# EasyEDA Pro project PCB.epro

# Board PCB_CardReader
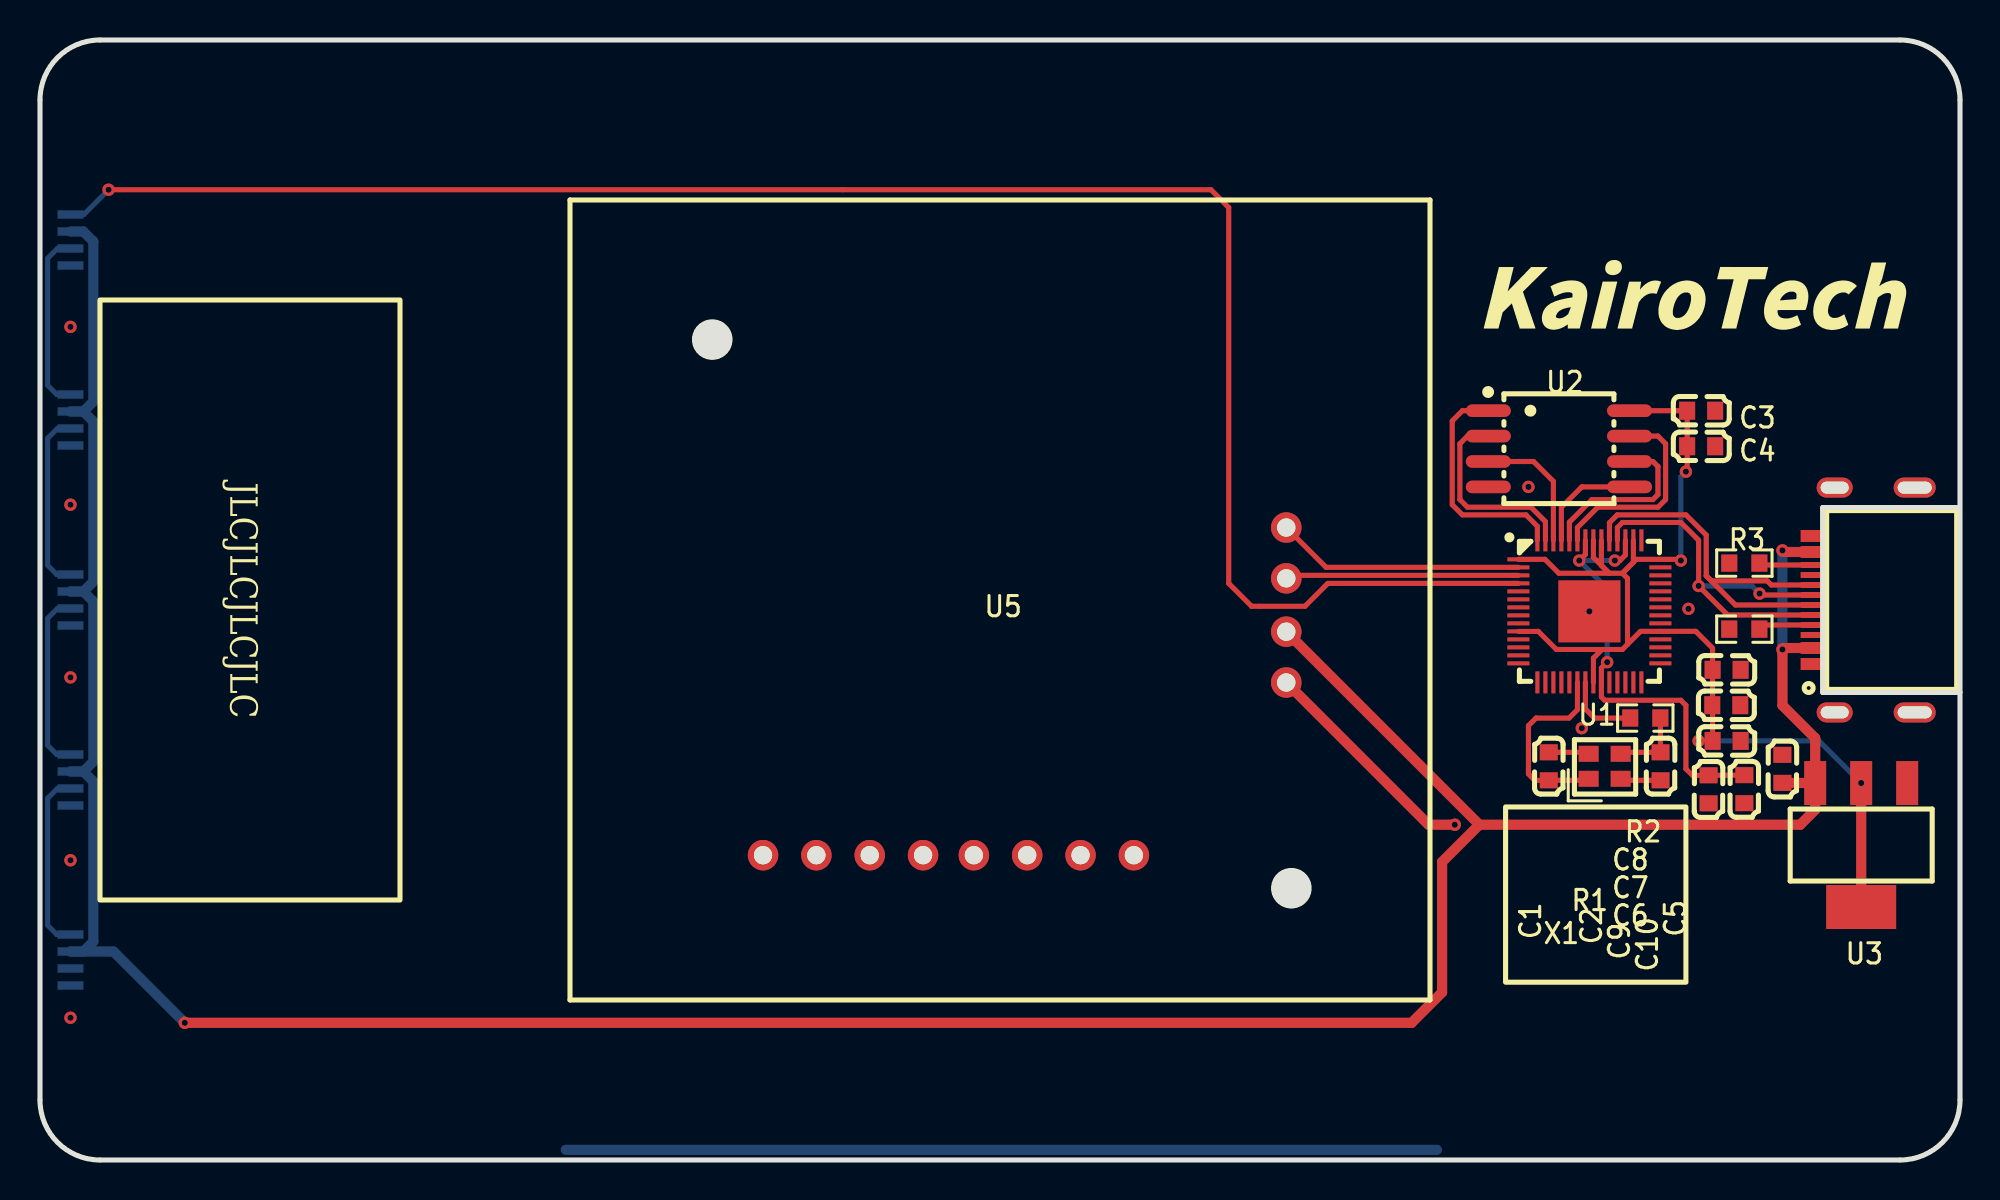
[diagram p0: board, top side]
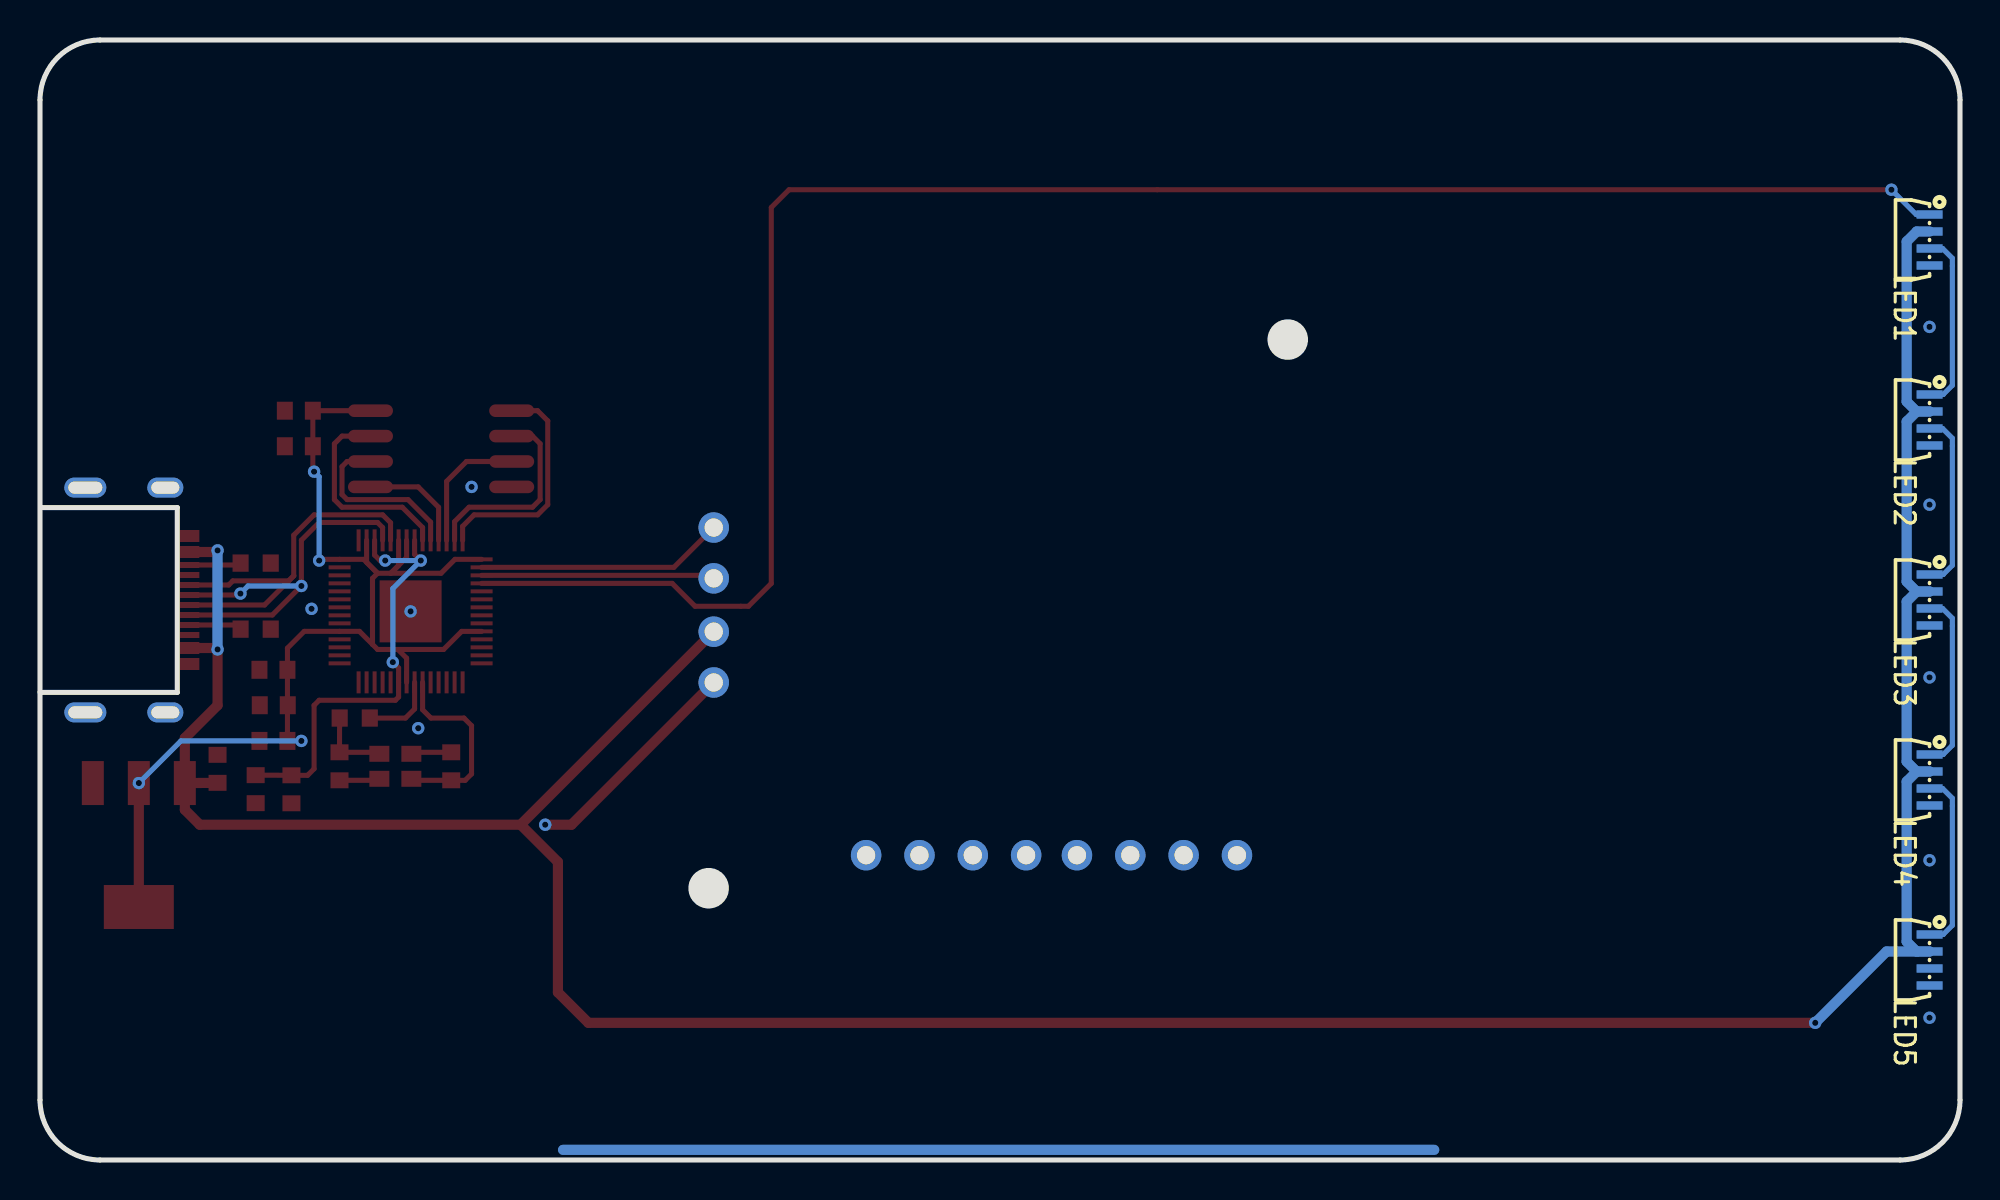
[diagram p1: board, bottom side, seen from below]

Outline 96 x 56 mm; copper layers: Top Layer, Bottom Layer. Coordinates in mm from the lower left corner of the outline.
Outline path: 0,53 arc(0.88,55.12) 3,56 93,56 arc(95.12,55.12) 96,53 96,3 arc(95.12,0.88) 93,0 3,0 arc(0.88,0.88) 0,3 0,53
Stack: Top Layer 0.035mm / Dielectric1 1.51mm FR4 er 4.5 / Bottom Layer 0.035mm

## Design rules (mm)
spacing Default (default): track to track 0.127, other pairs 0 to 0.127
track width Default (default): min 0.254, default 0.254, max 25.4
differential pair differentialPair (default): width min 0.127, default 0.254, max 2.54; gap min 0.152, default 0.152
via Default (default): diameter min 0.61, default 0.61, max 100.025; hole min 0.305, default 0.305, max 59.995
net GND uses gge8944
pour e61 uses gge8343
pour e62 uses gge8923
pour e219 uses gge8343(1)
pour e220 uses gge8944

## Placement (name value [footprint] x y rotation side)
C1  12pF  [C0603]  75.44 19.69 270 top
C2  12pF  [C0603]  81.03 19.69 270 top
C3  100nF  [C0603]  83.06 37.47 180 top
C4  100nF  [C0603]  83.06 35.69 180 top
C5  0.1u  [C0603]  87.12 19.56 90 top
C6  100nF  [C0603]  84.33 20.95 180 top
C7  100nF  [C0603]  84.31 22.74 180 top
C8  100nF  [C0603]  84.33 24.51 180 top
C9  100nF  [C0603]  83.43 18.53 90 top
C10  100nF  [C0603]  85.22 18.54 90 top
LED1  WS2812B-4020  [LED-SMD_WS2812B-4020]  1.52 46 90 bottom
LED2  WS2812B-4020  [LED-SMD_WS2812B-4020]  1.52 37 90 bottom
LED3  WS2812B-4020  [LED-SMD_WS2812B-4020]  1.52 28 90 bottom
LED4  WS2812B-4020  [LED-SMD_WS2812B-4020]  1.52 19 90 bottom
LED5  WS2812B-4020  [LED-SMD_WS2812B-4020]  1.52 10 90 bottom
R1  1k  [R0603]  80.26 22.1 180 top
R2  1k  [R0603]  85.22 26.54 0 top
R3  1k  [R0603]  85.22 29.84 0 top
U1  RP2040  [LQFN-56_L7.0-W7.0-P0.4-EP]  77.47 27.43 0 top
U2  W25Q32JVSSIQ_C2834491  [SOIC-8_L5.2-W5.2-P1.27-LS7.9-BL]  75.95 35.56 270 top
U3  AMS1117-5.0_C347223  [SOT-223_L6.7-W3.5-P2.30-BR]  91.06 15.75 90 top
U5  pn532  [PN532]  26.5 8 0 top
USB  TYPE-610-1.6-T3  [USB-C-SMD_TYPE-C-16P-610-1.6-T3]  91.13 28 90 top
X1  12MHz  [CRYSTAL-SMD_4P-L2.5-W2.0-BL_XTAL12MHZ]  78.23 19.69 0 top

## Footprints (pads in the part's own frame, mm; a bottom-side part is the same pattern mirrored in y, then rotated)
C0603
  rect 0.8x0.9 smd: 1(-0.7,0) 2(0.7,0)
CRYSTAL-SMD_4P-L2.5-W2.0-BL_XTAL12MHZ
  rect 1x0.8 smd: 1(-0.8,-0.625) 2(0.8,-0.625) 3(0.8,0.625) 4(-0.8,0.625)
LED-SMD_WS2812B-4020
  rect 0.42x1.3 smd: 1(1.275,0.001) 2(0.425,0.001) 3(-0.425,0.001) 4(-1.275,0.001)
LQFN-56_L7.0-W7.0-P0.4-EP
  rect 1.1x0.2 smd: 1(-3.55,2.6) 2(-3.55,2.2) 3(-3.55,1.8) 4(-3.55,1.4) 5(-3.55,1) 6(-3.55,0.6) 7(-3.55,0.2) 8(-3.55,-0.2) 9(-3.55,-0.6) 10(-3.55,-1) 11(-3.55,-1.4) 12(-3.55,-1.8) 13(-3.55,-2.2) 14(-3.55,-2.6) 29(3.55,-2.6) 30(3.55,-2.2) 31(3.55,-1.8) 32(3.55,-1.4) 33(3.55,-1) 34(3.55,-0.6) 35(3.55,-0.2) 36(3.55,0.2) 37(3.55,0.6) 38(3.55,1) 39(3.55,1.4) 40(3.55,1.8) 41(3.55,2.2) 42(3.55,2.6)
  rect 0.2x1.1 smd: 15(-2.6,-3.55) 16(-2.2,-3.55) 17(-1.8,-3.55) 18(-1.4,-3.55) 19(-1,-3.55) 20(-0.6,-3.55) 21(-0.2,-3.55) 22(0.2,-3.55) 23(0.6,-3.55) 24(1,-3.55) 25(1.4,-3.55) 26(1.8,-3.55) 27(2.2,-3.55) 28(2.6,-3.55) 43(2.6,3.55) 44(2.2,3.55) 45(1.8,3.55) 46(1.4,3.55) 47(1,3.55) 48(0.6,3.55) 49(0.2,3.55) 50(-0.2,3.55) 51(-0.6,3.55) 52(-1,3.55) 53(-1.4,3.55) 54(-1.8,3.55) 55(-2.2,3.55) 56(-2.6,3.55)
  rect 3.1x3.1 smd: 57(0,0)
PN532
  round 1.524 hole 0.914: 1(35.814,23.622) 2(35.814,21.082) 3(35.814,18.415) 4(35.814,15.875) 5(28.194,7.239) 6(25.527,7.239) 7(22.86,7.239) 8(20.193,7.239) 9(17.653,7.239) 10(14.986,7.239) 11(12.319,7.239) 12(9.652,7.239)
R0603
  rect 0.806x0.864 smd: 1(-0.753,0) 2(0.753,0)
SOIC-8_L5.2-W5.2-P1.27-LS7.9-BL
  oval 0.63x2.25 smd: 1(-1.905,-3.53) 2(-0.635,-3.53) 3(0.635,-3.53) 4(1.905,-3.53) 5(1.905,3.53) 6(0.635,3.53) 7(-0.635,3.53) 8(-1.905,3.53)
SOT-223_L6.7-W3.5-P2.30-BR
  rect 2.2x1.1 smd: 1(3.099,-2.3) 2(3.099,0) 3(3.099,2.3)
  rect 2.2x3.5 smd: 4(-3.099,0)
USB-C-SMD_TYPE-C-16P-610-1.6-T3
  oval 1x2.1 hole 0.6x1.7: 0(5.62,-2.6) 2(-5.62,-2.6)
  oval 1x1.8 hole 0.6x1.4: 1(5.62,1.4) 3(-5.62,1.4)
  rect 0.6x1 smd: A1B12(-3.2,2.6) A4B9(-2.4,2.6) B1A12(3.2,2.6) B4A9(2.4,2.6)
  rect 0.3x1 smd: A5(-1.25,2.6) A6(-0.25,2.6) A7(0.25,2.6) A8(1.25,2.6) B5(1.75,2.6) B6(0.75,2.6) B7(-0.75,2.6) B8(-1.75,2.6)

## Nets
1V1: C9.2 C10.2 U1.23 U1.45 U1.50
3V3: C3.2 C4.2 C6.2 C7.2 C8.2 U1.1 U1.10 U1.22 U1.33 U1.42 U1.44 U1.48 U1.49 U2.8 U3.2 U3.4
GND: C1.1 C2.2 C3.1 C4.1 C5.2 C6.1 C7.1 C8.1 C9.1 C10.1 LED1.4 LED2.4 LED3.4 LED4.4 LED5.4 R2.1 R3.1 U1.57 U2.4 U3.1 U5.4 USB.0 USB.1 USB.2 USB.3 USB.A1B12 USB.B1A12 X1.2 X1.4
VCC: C5.1 LED1.2 LED2.2 LED3.2 LED4.2 LED5.2 U3.3 U5.3 USB.A4B9 USB.B4A9
ADC_ACDD: U1.43
GPIO3: U1.5
GPIO4: U1.6
GPIO5: U1.7
GPIO6: U1.8
GPIO7: U1.9
GPIO8: U1.11
GPIO9: U1.12
GPIO10: U1.13
GPIO11: U1.14
GPIO12: U1.15
GPIO13: U1.16
GPIO14: U1.17
GPIO15: U1.18
GPIO16: U1.27
GPIO17: U1.28
GPIO18: U1.29
GPIO19: U1.30
GPIO20: U1.31
GPIO21: U1.32
GPIO22: U1.34
GPIO23: U1.35
GPIO24: U1.36
GPIO25: U1.37
GPIO26_ADC0: U1.38
GPIO27_ADC1: U1.39
GPIO28_ADC2: U1.40
GPIO29_ADC3: U1.41
LED: LED1.1 U1.4
LED1_3: LED1.3 LED2.1
LED2_3: LED2.3 LED3.1
LED3_3: LED3.3 LED4.1
LED4_3: LED4.3 LED5.1
QSPI_SCLK: U1.52 U2.6
QSPI_SD0: U1.53 U2.5
QSPI_SD1: U1.55 U2.2
QSPI_SD2: U1.54 U2.3
QSPI_SD3: U1.51 U2.7
QSPI_SS: U1.56 U2.1
RUN: U1.26
SWCLK: U1.24
SWD: U1.25
UART0_RX: U1.3 U5.2
UART0_TX: U1.2 U5.1
USB_A5: R2.2 USB.A5
USB_B5: R3.2 USB.B5
USB_D+: U1.47 USB.A6 USB.B6
USB_D-: U1.46 USB.A7 USB.B7
X1_3: C2.1 R1.1 X1.3
XIN: C1.2 U1.20 X1.1
XOUT: R1.2 U1.21

Pads without a net: LED5 3; U1 19; U5 5 6 7 8 9 10 11 12; USB A8 B8

## Via types
v1: diameter 0.62, hole 0.31, Top Layer to Bottom Layer, 23 vias

## Routing (per net, layer and track width the routed paths; a pad name or vN(x,y) marks a point on that pad's centre or on a via; arc(x,y) is an arc through that point)
1V1: length 22.4
  Top Layer w0.254: C9.2 82.62,19.23 82.3,19.56 82.3,22.73 82.04,22.99 78.23,22.99 78.07,23.15 U1.23 78.07,24.6 v1(78.36,24.89) ; U1.50 77.27,30.28 v1(76.96,29.97) ; 85.22,19.24 83.43,19.24 ; v1(78.74,29.97) 78.99,29.97 79.27,30.25 U1.45
  Bottom Layer w0.254: v1(78.36,24.89) 78.36,28.58 v1(76.96,29.97) v1(78.74,29.97)
3V3: length 61
  Top Layer w0.254: 79.38,25.78 80.03,26.43 U1.33 82.79,26.43 83.63,25.59 C8.2 C6.2 ; 79.38,25.78 79.12,25.53 78.1,25.53 ; 79.38,25.78 79.38,29.08 79.12,29.34 ; 79.12,29.34 75.95,29.34 75.25,30.03 U1.1 ; 79.12,29.34 79.82,30.03 U1.42 81.98,30.03 v1(82.04,29.97) ; 79.12,29.34 79.67,29.89 U1.44 ; 78.1,25.53 77.67,25.09 77.67,23.88 ; 78.1,25.53 75.82,25.53 74.91,26.43 U1.10 ; 78.07,30.98 78.07,29.73 78.46,29.34 77.67,30.13 77.67,30.98 ; U2.8 C3.2 C4.2 82.36,34.48 v1(82.3,34.42)
  Top Layer w0.508: v1(91.06,18.85) U3.4
  Bottom Layer w0.254: v1(82.3,34.42) 82.04,34.16 v1(82.04,29.97) ; v1(82.93,20.95) 88.95,20.95 v1(91.06,18.85)
GND: length 59
  Top Layer w0.254: C1.1 77.36,20.39 X1.4 ; X1.2 79.11,18.98 C2.2
  Top Layer w0.508: v1(70.74,16.76) 69.43,16.76 U5.4
  Bottom Layer w0.508: 69.85,0.51 26.29,0.51
  vias: v1(1.52,41.66) v1(1.52,32.77) v1(1.52,24.13) v1(1.52,14.99) v1(1.52,7.11) v1(74.42,33.66) v1(77.09,21.59) v1(77.47,27.43) v1(82.42,27.56)
VCC: length 176.5
  Top Layer w0.508: v1(7.24,6.86) 68.58,6.86 70.1,8.38 70.1,14.9 71.97,16.76 ; v1(87.12,30.48) 87.2,30.4 USB.B4A9 ; USB.A4B9 87.19,25.6 v1(87.12,25.53) 87.12,22.73 88.76,21.1 U3.3 ; 87.12,18.86 88.76,18.85 88.76,17.51 88.01,16.76 71.97,16.76 ; 71.97,16.76 U5.3
  Bottom Layer w0.254: v1(87.12,30.48) v1(87.12,25.53)
  Bottom Layer w0.508: 1.52,19.43 2.16,19.43 2.67,18.92 2.67,10.92 2.17,10.42 LED5.2 3.67,10.42 v1(7.24,6.86) ; 1.52,28.43 2.16,28.43 2.67,27.92 2.67,19.92 2.17,19.42 LED4.2 ; LED3.2 2.17,28.42 2.67,28.92 2.67,36.92 2.16,37.43 1.52,37.43 ; LED2.2 2.17,37.42 2.67,37.92 2.67,45.92 2.16,46.43 1.52,46.43 ; v1(87.12,30.48) v1(87.12,25.53)
LED: length 93
  Top Layer w0.254: v1(3.43,48.51) 58.55,48.51 59.44,47.62 59.44,28.83 60.58,27.69 63.25,27.69 64.39,28.83 U1.4
  Bottom Layer w0.254: v1(3.43,48.51) 2.19,47.28 LED1.1
LED1_3: length 9
  Bottom Layer w0.254: LED1.3 0.87,45.58 0.38,45.08 0.38,38.73 0.84,38.28 LED2.1
LED2_3: length 9
  Bottom Layer w0.254: LED2.3 0.87,36.58 0.38,36.08 0.38,29.73 0.84,29.28 LED3.1
LED3_3: length 9
  Bottom Layer w0.254: LED3.3 0.87,27.58 0.38,27.08 0.38,20.73 0.84,20.28 LED4.1
LED4_3: length 9
  Bottom Layer w0.254: LED5.1 0.84,11.28 0.38,11.73 0.38,18.08 0.87,18.58 LED4.3
QSPI_SCLK: length 8.8
  Top Layer w0.254: 76.47,30.98 76.47,31.89 77.6,33.02 80.65,33.02 80.9,33.27 80.9,34.67 80.65,34.92 U2.6
QSPI_SD0: length 5.5
  Top Layer w0.254: U1.53 76.07,32.64 77.09,33.66 U2.5
QSPI_SD1: length 10
  Top Layer w0.254: 75.27,30.98 75.27,31.92 74.55,32.64 71.37,32.64 70.99,33.02 70.99,35.81 71.37,36.19 U2.2
QSPI_SD2: length 6.6
  Top Layer w0.254: U2.3 74.68,34.92 75.67,33.93 U1.54
QSPI_SD3: length 10.4
  Top Layer w0.254: U2.7 80.9,36.19 81.28,35.81 81.28,33.02 80.9,32.64 77.89,32.64 76.87,31.62 76.87,30.98
QSPI_SS: length 11.6
  Top Layer w0.254: 74.87,30.98 74.87,31.68 74.29,32.26 71.12,32.26 70.61,32.77 70.61,36.96 71.12,37.47 U2.1
UART0_RX: length 11.7
  Top Layer w0.254: U5.2 62.46,29.23 U1.3
UART0_TX: length 12.4
  Top Layer w0.254: U5.1 64.31,29.63 U1.2
USB_A5: length 2.9
  Top Layer w0.254: 88.79,26.75 86.18,26.75 R2.2
USB_B5: length 2.9
  Top Layer w0.254: 88.79,29.75 86.07,29.75 R3.2
USB_D+: length 20.1
  Top Layer w0.254: 83.31,29.21 83.57,28.96 86.36,28.96 86.57,28.75 88.79,28.75 ; 83.31,29.21 84.77,27.75 88.79,27.75 ; 83.31,29.21 83.31,31.24 82.3,32.26 78.87,32.26 78.47,31.86 78.47,30.98
USB_D-: length 20
  Top Layer w0.254: 88.79,27.25 84.38,27.25 v1(82.93,28.7) 82.93,30.99 82.04,31.88 79.12,31.88 78.87,31.62 78.87,30.98 ; 88.79,28.25 86.05,28.25 v1(85.98,28.32)
  Bottom Layer w0.254: v1(85.98,28.32) 85.6,28.7 v1(82.93,28.7)
X1_3: length 3.7
  Top Layer w0.254: C2.1 79.11,20.39 X1.3 ; 81.03,20.39 R1.1
XIN: length 9.7
  Top Layer w0.254: X1.1 77.36,18.98 C1.2 74.74,18.98 74.42,19.3 74.42,21.72 74.8,22.1 76.45,22.1 76.87,22.51 76.87,23.88
XOUT: length 3.8
  Top Layer w0.254: U1.21 77.27,22.55 77.72,22.1 R1.2

## Copper pours and planes (outline as drawn; the poured copper is in the pictures)
GND on Top Layer: 69.6,59.06 69.72,58.93 103.76,58.93 103.89,58.8 103.89,-2.29 69.6,-2.29
GND on Top Layer: 26.67,61.21 26.03,60.58 -2.54,60.58 -1.91,59.94 -1.91,-2.16 -1.78,-2.03 26.54,-2.03
GND on Bottom Layer: -1.14,57.15 -0.89,57.4 26.42,57.4 26.54,57.28 26.54,-0.38 26.29,-0.13 -1.02,-0.13
GND on Bottom Layer: 69.66,60.45 69.79,60.33 103.82,60.33 104.84,61.85 103.95,-0.89 69.66,-0.89

## Text on the board
Top Silkscreen Layer: JLCJLCJLCJLC
